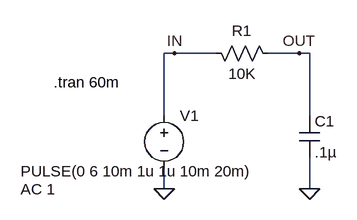
[diagram p0: schematic low pass.asc]
low pass.asc, the LTspice schematic file:
Version 4.1
SHEET 1 880 680
WIRE 112 16 96 16
WIRE 176 16 112 16
WIRE 304 16 256 16
WIRE 320 16 304 16
WIRE 96 112 96 16
WIRE 320 112 320 16
WIRE 96 224 96 192
WIRE 320 224 320 176
FLAG 96 224 0
FLAG 320 224 0
FLAG 112 16 IN
FLAG 304 16 OUT
SYMBOL voltage 96 96 R0
WINDOW 3 -221 101 Left 2
WINDOW 123 -221 129 Left 2
WINDOW 39 0 0 Left 0
SYMATTR InstName V1
SYMATTR Value PULSE(0 6 10m 1u 1u 10m 20m)
SYMATTR Value2 AC 1
SYMBOL res 160 0 M90
WINDOW 0 -3 56 VBottom 2
WINDOW 3 32 56 VTop 2
SYMATTR InstName R1
SYMATTR Value 10K
SYMATTR SpiceLine tol=1 pwr=0.1
SYMBOL cap 304 112 R0
SYMATTR InstName C1
SYMATTR Value .1µ
TEXT -74 60 Left 2 !.tran 60m

The netlist it stands for:
* low pass.asc
V1 IN 0 PULSE(0 6 10m 1u 1u 10m 20m) AC 1
R1 IN OUT 10K tol=1 pwr=0.1
C1 OUT 0 .1µ
.tran 60m
.backanno
.end